# EAGLE schematic eCog101_I2C_TFT_.96 (EAGLE 6.6.0)
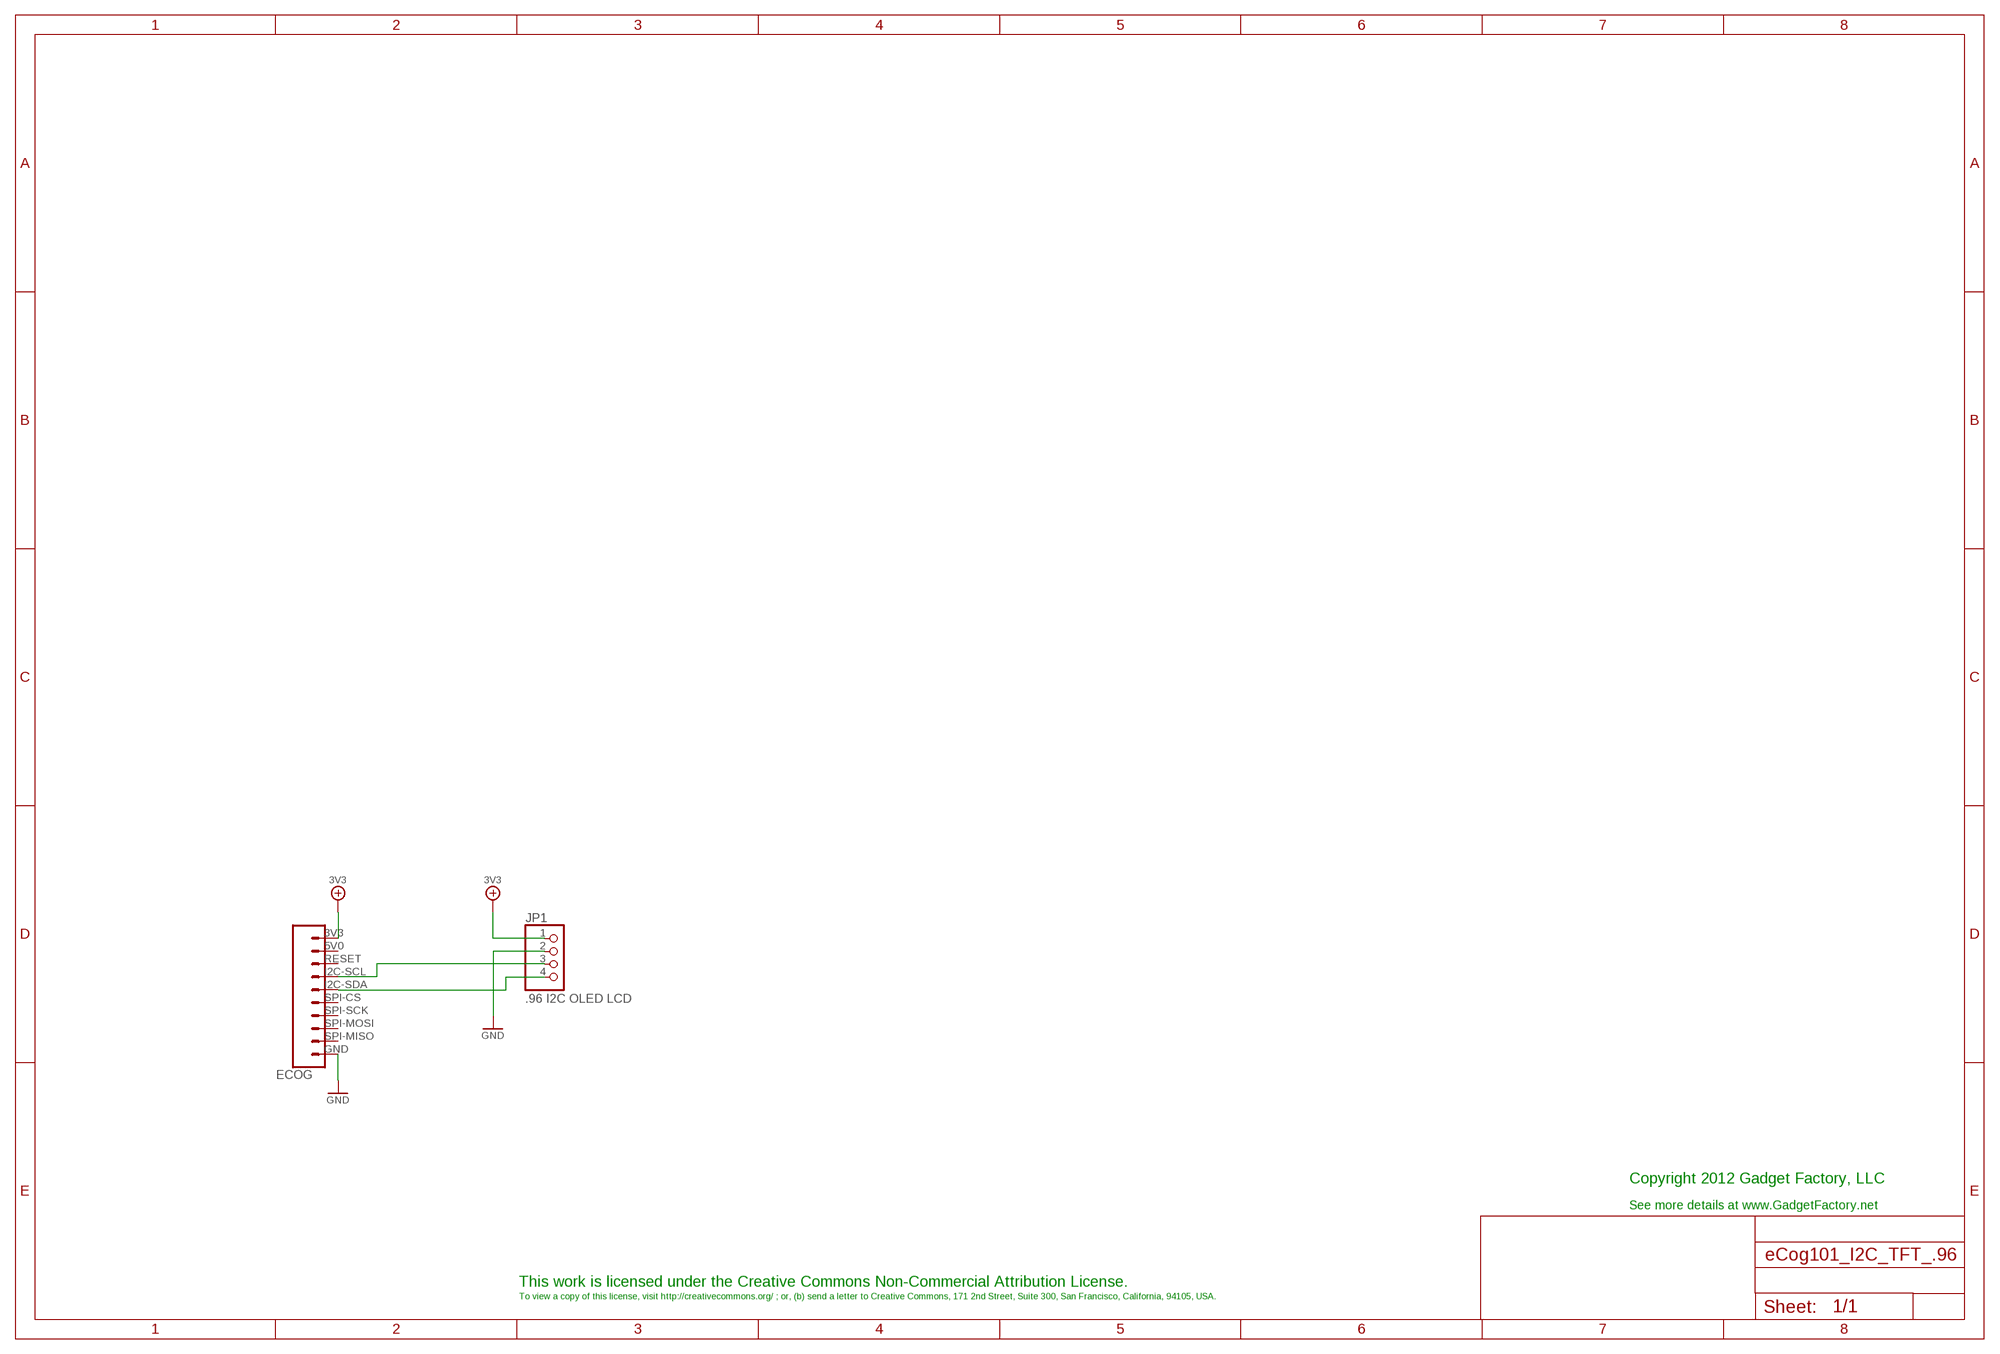
[diagram p0: schematic, sheet 1]

## Parts
ECOG  ECOG_BUSES_ROWSURFACEMOUNT  [ECOG_BUSES_SMD]
JP1  .96 I2C OLED LCD  PINHD-1X4  [1X04]

## Nets
3V3: ECOG.3V3 JP1.1
GND: ECOG.GND JP1.2
N$1: ECOG.I2C-SCL JP1.3
N$2: ECOG.I2C-SDA JP1.4
Unconnected: ECOG.5V0(RSV) ECOG.RESET(RSV) ECOG.SPI-CS ECOG.SPI-MISO ECOG.SPI-MOSI ECOG.SPI-SCK

## Notes on the sheet
- Copyright 2012 Gadget Factory, LLC
- See more details at www.GadgetFactory.net
- This work is licensed under the Creative Commons Non-Commercial Attribution License.
- To view a copy of this license, visit http://creativecommons.org/ ; or, (b) send a letter to Creative Commons, 171 2nd Street, Suite 300, San Francisco, California, 94105, USA.

## Library data of the parts
ECOG = eCogs:ECOG_BUSES_ROW; DIGIKEY: S1013EC-10-ND
JP1 = pinhead:PINHD-1X4: PIN HEADER; DEALEXTREME: 419232